# Altium project GreenHouse-hwd.PrjPcb (part 1 of 2)
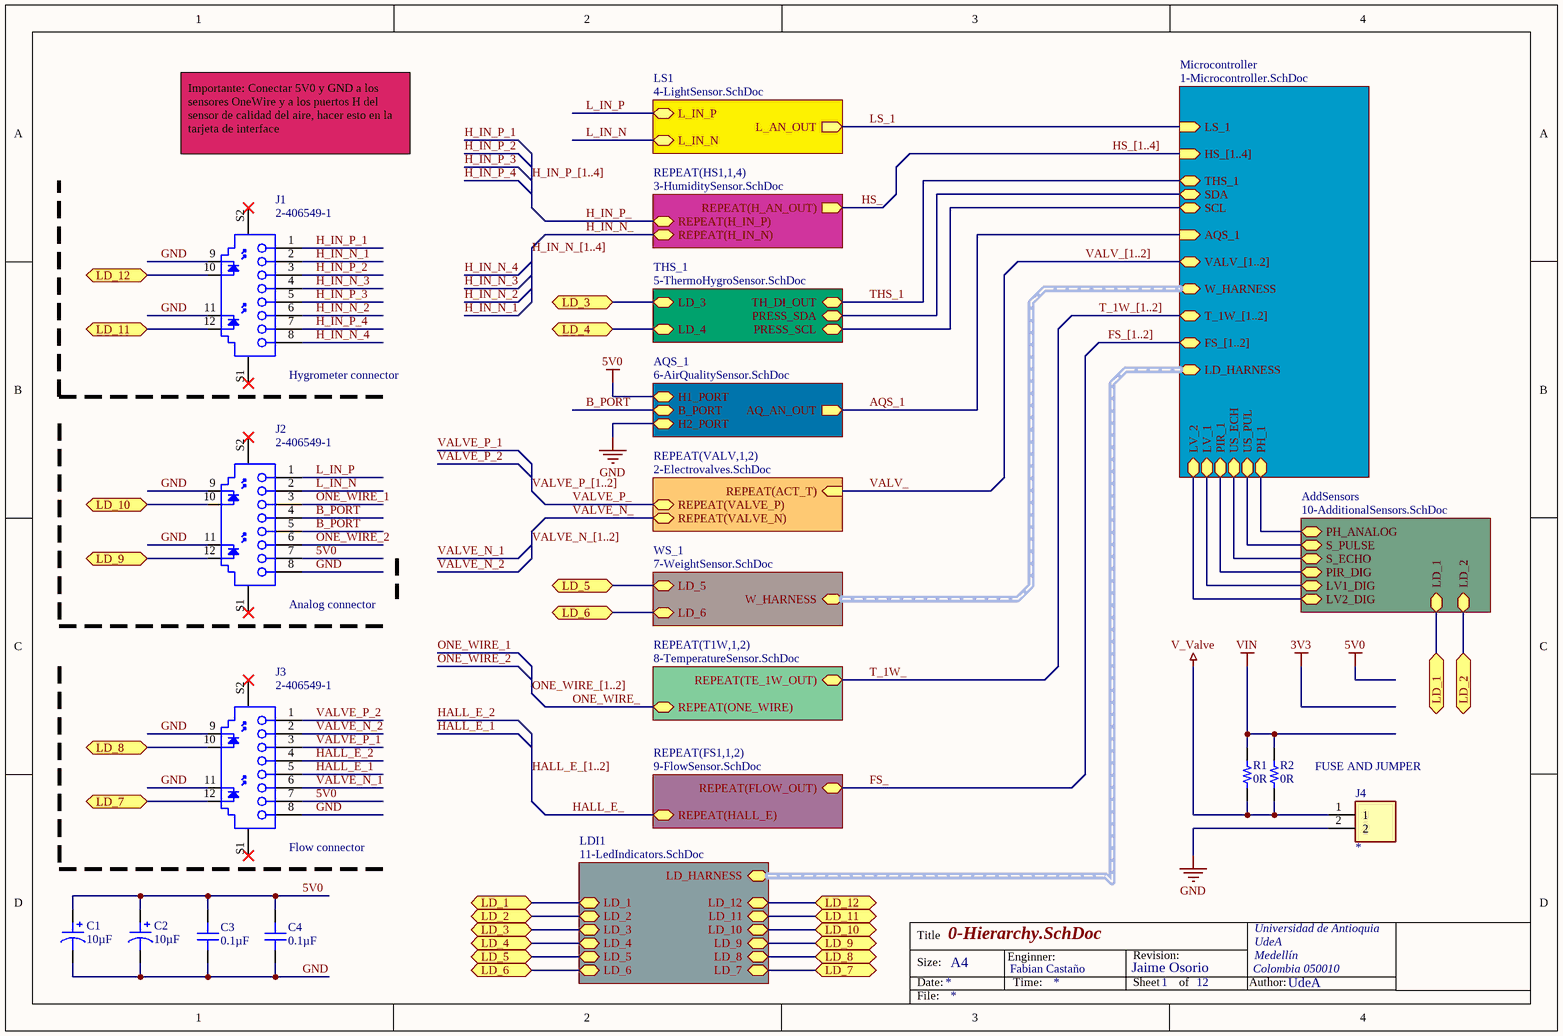
[diagram p0: 0-Hierarchy.SchDoc]
12 sheets, 90 parts. Net scope: hierarchical (ports join the sheet entries above them; power ports are global).
Board file: GreenHose-PCB.PcbDoc
Sheets:
  0-Hierarchy.SchDoc
    Microcontroller = 1-Microcontroller.SchDoc
    HS11 = 3-HumiditySensor.SchDoc
    HS12 = 3-HumiditySensor.SchDoc
    HS13 = 3-HumiditySensor.SchDoc
    HS14 = 3-HumiditySensor.SchDoc
    LS1 = 4-LightSensor.SchDoc
    THS_1 = 5-ThermoHygroSensor.SchDoc
    AQS_1 = 6-AirQualitySensor.SchDoc
    VALV1 = 2-Electrovalves.SchDoc
    VALV2 = 2-Electrovalves.SchDoc
    WS_1 = 7-WeightSensor.SchDoc
    T1W1 = 8-TemperatureSensor.SchDoc
    T1W2 = 8-TemperatureSensor.SchDoc
    FS11 = 9-FlowSensor.SchDoc
    FS12 = 9-FlowSensor.SchDoc
    AddSensors = 10-AdditionalSensors.SchDoc
    LDI1 = 11-LedIndicators.SchDoc

## Sheet 0-Hierarchy.SchDoc
size A4; Author: Fabian Castaño; CompanyName: UdeA; Engineer: Fabian Castaño; Organization: Universidad de Antioquia; Address1: UdeA; Address2: Medellín; Address3: Antioquia; Address4: Colombia 050010; DocumentNumber: 1; Revision: Jaime Osorio; SheetNumber: 1; SheetTotal: 12

### Parts
C1  10µF  [CAP POL 1206_3216]
C2  10µF  [CAP POL 1206_3216]
C3  0.1µF  [CAP 0805_2012]
C4  0.1µF  [CAP 0805_2012]
J1  2-406549-1  [TECO-2-406549-1_V]
J2  2-406549-1  [TECO-2-406549-1_V]
J3  2-406549-1  [TECO-2-406549-1_V]
J4  282841-2  [TE_282841-2]  (value not drawn)
R1  0R  [RES 0805_2012]
R2  0R  [RES 0805_2012]

### Sub-sheets
AddSensors = 10-AdditionalSensors.SchDoc: PH_ANALOG, S_PULSE, S_ECHO, PIR_DIG, LV1_DIG, LV2_DIG, LD_1 (bidir), LD_2 (bidir)
AQS_1 = 6-AirQualitySensor.SchDoc: AQ_AN_OUT (out), B_PORT, H1_PORT, H2_PORT
LDI1 = 11-LedIndicators.SchDoc: LD_HARNESS (harness LedHarness), LD_1, LD_2, LD_3, LD_4, LD_5, LD_6, LD_7, LD_8, LD_9, LD_10, LD_11, LD_12
LS1 = 4-LightSensor.SchDoc: L_AN_OUT (out), L_IN_P, L_IN_N
Microcontroller = 1-Microcontroller.SchDoc: HS_[1..4] (in), LS_1 (in), THS_1, AQS_1 (in), VALV_[1..2], W_HARNESS (harness Weight_Harness), T_1W_[1..2], FS_[1..2], SDA, SCL, LV_2, LV_1, PIR_1, US_ECH, US_PUL, PH_1, LD_HARNESS (harness LedHarness)
REPEAT(FS1,1,2) = 9-FlowSensor.SchDoc: REPEAT(FLOW_OUT), REPEAT(HALL_E)
REPEAT(HS1,1,4) = 3-HumiditySensor.SchDoc: REPEAT(H_AN_OUT) (out), REPEAT(H_IN_P), REPEAT(H_IN_N)
REPEAT(T1W,1,2) = 8-TemperatureSensor.SchDoc: REPEAT(TE_1W_OUT), REPEAT(ONE_WIRE)
REPEAT(VALV,1,2) = 2-Electrovalves.SchDoc: REPEAT(ACT_T) (in), REPEAT(VALVE_N), REPEAT(VALVE_P)
THS_1 = 5-ThermoHygroSensor.SchDoc: TH_DI_OUT, PRESS_SDA, PRESS_SCL, LD_3, LD_4
WS_1 = 7-WeightSensor.SchDoc: W_HARNESS (harness Weight_Harness), LD_5, LD_6

### Ports
LD_1 (bidir), LD_2 (bidir), LD_3 (bidir), LD_4 (bidir), LD_5 (bidir), LD_6 (bidir), LD_7 (bidir), LD_8 (bidir), LD_9 (bidir), LD_10 (bidir), LD_11 (bidir), LD_12 (bidir)

### Nets
5V0: C1.1 C2.1 C3.2 C4.2 J2.7 J3.7 ; sheet AQS_1/H1_PORT
GND: C1.2 C2.2 C3.1 C4.1 J1.9 J1.11 J2.8 J2.9 J2.11 J3.8 J3.9 J3.11 J4.2 ; sheet AQS_1/H2_PORT
V_Valve: J4.1 R1.1 R2.1
VIN: R1.2 R2.2
AQS_1: J2.4 J2.5 ; sheet Microcontroller/AQS_1, sheet AQS_1/AQ_AN_OUT, sheet AQS_1/B_PORT  [also labelled B_PORT]
FS_: sheet REPEAT(FS1,1,2)/REPEAT(FLOW_OUT)
H_IN_N_: sheet REPEAT(HS1,1,4)/REPEAT(H_IN_N)
H_IN_N_1: J1.2
H_IN_N_2: J1.6
H_IN_N_3: J1.4
H_IN_N_4: J1.8
H_IN_P_: sheet REPEAT(HS1,1,4)/REPEAT(H_IN_P)
H_IN_P_1: J1.1  [also labelled HS_1]
H_IN_P_2: J1.3  [also labelled HS_2]
H_IN_P_3: J1.5  [also labelled HS_3]
H_IN_P_4: J1.7  [also labelled HS_4]
HALL_E_: sheet REPEAT(FS1,1,2)/REPEAT(HALL_E)
HALL_E_1: J3.5
HALL_E_2: J3.4
HS_: sheet REPEAT(HS1,1,4)/REPEAT(H_AN_OUT)
L_IN_N: J2.2 ; sheet LS1/L_IN_N
L_IN_P: J2.1 ; sheet Microcontroller/LS_1, sheet LS1/L_AN_OUT, sheet LS1/L_IN_P  [also labelled LS_1]
ONE_WIRE_: sheet REPEAT(T1W,1,2)/REPEAT(ONE_WIRE)
ONE_WIRE_1: J2.3
ONE_WIRE_2: J2.6
T_1W_: sheet REPEAT(T1W,1,2)/REPEAT(TE_1W_OUT)
THS_1: sheet Microcontroller/THS_1, sheet THS_1/TH_DI_OUT
VALV_: sheet REPEAT(VALV,1,2)/REPEAT(ACT_T)
VALVE_N_: sheet REPEAT(VALV,1,2)/REPEAT(VALVE_N)
VALVE_N_1: J3.6
VALVE_N_2: J3.2
VALVE_P_: sheet REPEAT(VALV,1,2)/REPEAT(VALVE_P)
VALVE_P_1: J3.3
VALVE_P_2: J3.1
NetJ1_10: J1.10 ; port LD_12, sheet LDI1/LD_12
NetJ1_12: J1.12 ; port LD_11, sheet LDI1/LD_11
NetJ2_10: J2.10 ; port LD_10, sheet LDI1/LD_10
NetJ2_12: J2.12 ; port LD_9, sheet LDI1/LD_9
NetJ3_10: J3.10 ; port LD_8, sheet LDI1/LD_8
NetJ3_12: J3.12 ; port LD_7, sheet LDI1/LD_7
NetJ5_4: sheet Microcontroller/SDA, sheet THS_1/PRESS_SDA
NetJ5_5: sheet Microcontroller/SCL, sheet THS_1/PRESS_SCL
NetJ5_10: port LD_4, sheet THS_1/LD_4, sheet LDI1/LD_4
NetJ5_12: port LD_3, sheet THS_1/LD_3, sheet LDI1/LD_3
NetJ6_10: port LD_6, sheet WS_1/LD_6, sheet LDI1/LD_6
NetJ6_12: port LD_5, sheet WS_1/LD_5, sheet LDI1/LD_5
NetJ8_1: sheet Microcontroller/US_PUL, sheet AddSensors/S_PULSE
NetJ8_2: sheet Microcontroller/US_ECH, sheet AddSensors/S_ECHO
NetJ8_3: sheet Microcontroller/PIR_1, sheet AddSensors/PIR_DIG
NetJ8_4: sheet Microcontroller/LV_1, sheet AddSensors/LV1_DIG
NetJ8_5: sheet Microcontroller/LV_2, sheet AddSensors/LV2_DIG
NetJ8_6: sheet Microcontroller/PH_1, sheet AddSensors/PH_ANALOG
NetJ8_10: port LD_2, sheet AddSensors/LD_2, sheet LDI1/LD_2
NetJ8_12: port LD_1, sheet AddSensors/LD_1, sheet LDI1/LD_1

Not connected (* = marked no-connect by the designer): J1 S1* S2*; J2 S1* S2*; J3 S1* S2*

### Buses and harness runs
bus FS_[1..2] = sheet Microcontroller/FS_[1..2]
bus H_IN_N_[1..4]
bus H_IN_P_[1..4]
bus HALL_E_[1..2]
bus HS_[1..4] = sheet Microcontroller/HS_[1..4]
bus ONE_WIRE_[1..2]
bus T_1W_[1..2] = sheet Microcontroller/T_1W_[1..2]
bus VALV_[1..2] = sheet Microcontroller/VALV_[1..2]
bus VALVE_N_[1..2]
bus VALVE_P_[1..2]
harness sheet LDI1/LD_HARNESS = sheet Microcontroller/LD_HARNESS
harness sheet Microcontroller/W_HARNESS = sheet WS_1/W_HARNESS

### Notes on the sheet
- Importante: Conectar 5V0 y GND a los sensores OneWire y a los puertos H del sensor de calidad del aire, hacer esto en la tarjeta de interface
- (near J1) Hygrometer connector
- (near J2) Analog connector
- FUSE AND JUMPER
- (near J3) Flow connector
- Title
- Size:
- Date:
- A4
- Enginner:
- Time:
- Revision:
- Sheet
- of
- Author:
- File:

### Library data of the parts
C1 C2 = TCNK106M025R0350: CAP TANT POLY 10UF 25V 1206; Manufacturer: AVX Corporation; Manufacturer Size Code: K; ESR (Equivalent Series Resistance): 350mOhm @ 100kHz; Lifetime @ Temp.: 2000 Hrs @ 105°C; Tolerance: ±20%; Type: Molded; Part Number: TCNK106M025R0350; Value: 10µF; Capacitance: 10µF; ComponentLink1Description: Datasheet; ComponentLink1URL: http://datasheets.avx.com/TCN_Undertab.pdf; ComponentLink2Description: DigiKey Link; ComponentLink2URL: http://digikey.com/product-detail/en/avx-corporation/TCNK106M025R0350/478-12519-1-ND/9836496; Device Package: 1206 (3216 Metric); Features: General Purpose; Height - Seated (Max): 0.039" (1.00mm); LastUpdated: 2/09/2020 01:16:26; Lifecycle Status: Active; Minimum Order: 1; Mounting Type: Surface Mount; Operating Temperature: -55°C ~ 105°C; Package / Case: 1206 (3216 Metric); Packaging: TapeAndReel; PartId: 2; Part Status: Active; Price: 0.41; Series: TCN; Size / Dimension: 0.126" L x 0.063" W (3.20mm x 1.60mm); Supplier 1: DigiKey; Supplier Part Number 1: 478-12519-1-ND; Voltage - Rated: 25V
C3 C4 = C0805C104M5RACAUTO: CAP CER 0.1UF 50V X7R 0805; Manufacturer: KEMET; Tolerance: ±20%; Part Number: C0805C104M5RACAUTO; Value: 0.1µF; Applications: Automotive, Bypass, Decoupling; Capacitance: 0.1µF; ComponentLink1Description: Datasheet; ComponentLink1URL: https://api.kemet.com/component-edge/download/datasheet/C0805C104M5RACAUTO.pdf; ComponentLink2Description: DigiKey Link; ComponentLink2URL: http://digikey.com/product-detail/en/kemet/C0805C104M5RACAUTO/399-12977-1-ND/5762259; Device Package: 0805 (2012 Metric); LastUpdated: 2/09/2020 01:04:42; Lifecycle Status: Active; Minimum Order: 1; Mounting Type: Surface Mount, MLCC; Operating Temperature: -55°C ~ 125°C; Package / Case: 0805 (2012 Metric); Packaging: TapeAndReel; PartId: 2568; Part Status: Active; Price: 0.02; Ratings: AEC-Q200; Series: SMD Auto X7R; Size / Dimension: 0.079" L x 0.049" W (2.00mm x 1.25mm); Supplier 1: DigiKey; Supplier Part Number 1: 399-12977-1-ND; Temperature Coefficient: X7R; Thickness (Max): 0.035" (0.88mm); Voltage - Rated: 50V
J1-J3 = CMP-2000-05541-1: RJ45 Connector, Pitch 1.016 mm, 8 Position, Height 14.22 mm, Tail Length 3.18 mm, RoHS, Tray; Manufacturer: TE Connectivity; Number of Ports: 1; Tab Direction: Up; Ratings: Cat5; Catalog Drawings: JackSideEntryInverted / JackSideEntryInvertedSide; Number of Positions/Contacts: 8p8c(RJ45,Ethernet); 3D Model: 2-406549-1.pdf; Other Names: 2-406549-1-ND / A97715; Shielding: Shielded,EMIFinger; LED Color: Yellow-Green; Dynamic Catalog: ModularJacks; Connector Type: Jack; Termination: Solder; Mounting Type: ThroughHole; Datasheet URL: http://www.te.com/commerce/DocumentDelivery/DDEController?Action=showdoc&DocId=Customer+Drawing%7F406549%7FT%7Fpdf%7FEnglish%7FENG_CD_406549_T.pdf%7F2-406549-1; Mounting Technology: ThroughHole; Package Reference: 2-406549-1; RoHS Information: 2-406549-1StatementofCompliance; Housing Material: Thermoplastic; Standard Package: 63; Number of Rows: 1; Category: Connectors,Interconnects; Contact Material: PhosphorBronze; Contact Finish Thickness: 50µin(1.27µm); Family: ModularConnectors-Jacks; Packaging: Tray; Datasheet Version: Rev. T, 11/2014; Operating Temperature: -40°C~85°C; Orientation: 90°Angle(Right); Contact Finish: Gold; Features: BoardGuide; Package Description: RJ45 Connector, Pitch 1.016 mm, 8 Position, Height 14.22 mm, Tail Length 3.18 mm; Manufacturer URL: http://www.te.com/
J4 = 282841-2: Conn Terminal Block 2 POS 5.08mm Solder ST Thru-Hole 17.5A/Contact; MF: TE Connectivity; SnapEDA_Link: https://www.snapeda.com/parts/282841-2/TE%20Connectivity%20AMP%20Connectors/view-part/434231/?ref=snap; Availability: Unavailable; TE_purchase_URL: https://www.te.com/usa-en/product-282841-2.html?te_bu=Cor&te_type=disp&te_campaign=seda_glo_cor-seda-global-disp-prtnr-fy19-seda-model-bom-cta_sma-317_1&elqCampaignId=32493; Value: *; EU_RoHS_Compliance: Compliant with Exemptions; Price: None; MP: 282841-2; Package: None; Comment_1: *
R1 R2 = RC0805FR-071K47L: RES SMD 1.47K OHM 1% 1/8W 0805; Manufacturer: Yageo; Power (Watts): 0.125W, 1/8W; Resistance: 1.47 kOhms; Temperature Coefficient: ±100ppm/°C; Part Number: RC0805FR-071K47L; Value: 0R; ComponentLink1Description: Datasheet; ComponentLink1URL: https://www.yageo.com/upload/media/product/productsearch/datasheet/rchip/PYu-RC_Group_51_RoHS_L_10.pdf; ComponentLink2Description: DigiKey Link; ComponentLink2URL: http://digikey.com/product-detail/en/yageo/RC0805FR-071K47L/311-1.47KCRCT-ND/730440; Composition: Thick Film; Device Package: 0805 (2012 Metric); Features: Moisture Resistant; Height - Seated (Max): 0.024" (0.60mm); LastUpdated: 2/09/2020 01:14:46; Lifecycle Status: Active; Minimum Order: 1; Number of Terminations: 2; Operating Temperature: -55°C ~ 155°C; Package / Case: 0805 (2012 Metric); Packaging: CutTape; PartId: 44768; Part Status: Active; Price: 0.10; Series: RC; Size / Dimension: 0.079" L x 0.049" W (2.00mm x 1.25mm); Supplier 1: DigiKey; Supplier Part Number 1: 311-1.47KCRCT-ND; Supplier Device Package: 0805; Tolerance: ±1%

## Sheet 1-Microcontroller.SchDoc
size A4; Author: Fabian Castaño; CompanyName: UdeA; Engineer: Fabian Castaño; Organization: Universidad de Antioquia; Address1: UdeA; Address2: Medellín; Address3: Antioquia; Address4: Colombia 050010; DocumentNumber: 2; Revision: Jaime Osorio; SheetNumber: 2; SheetTotal: 12
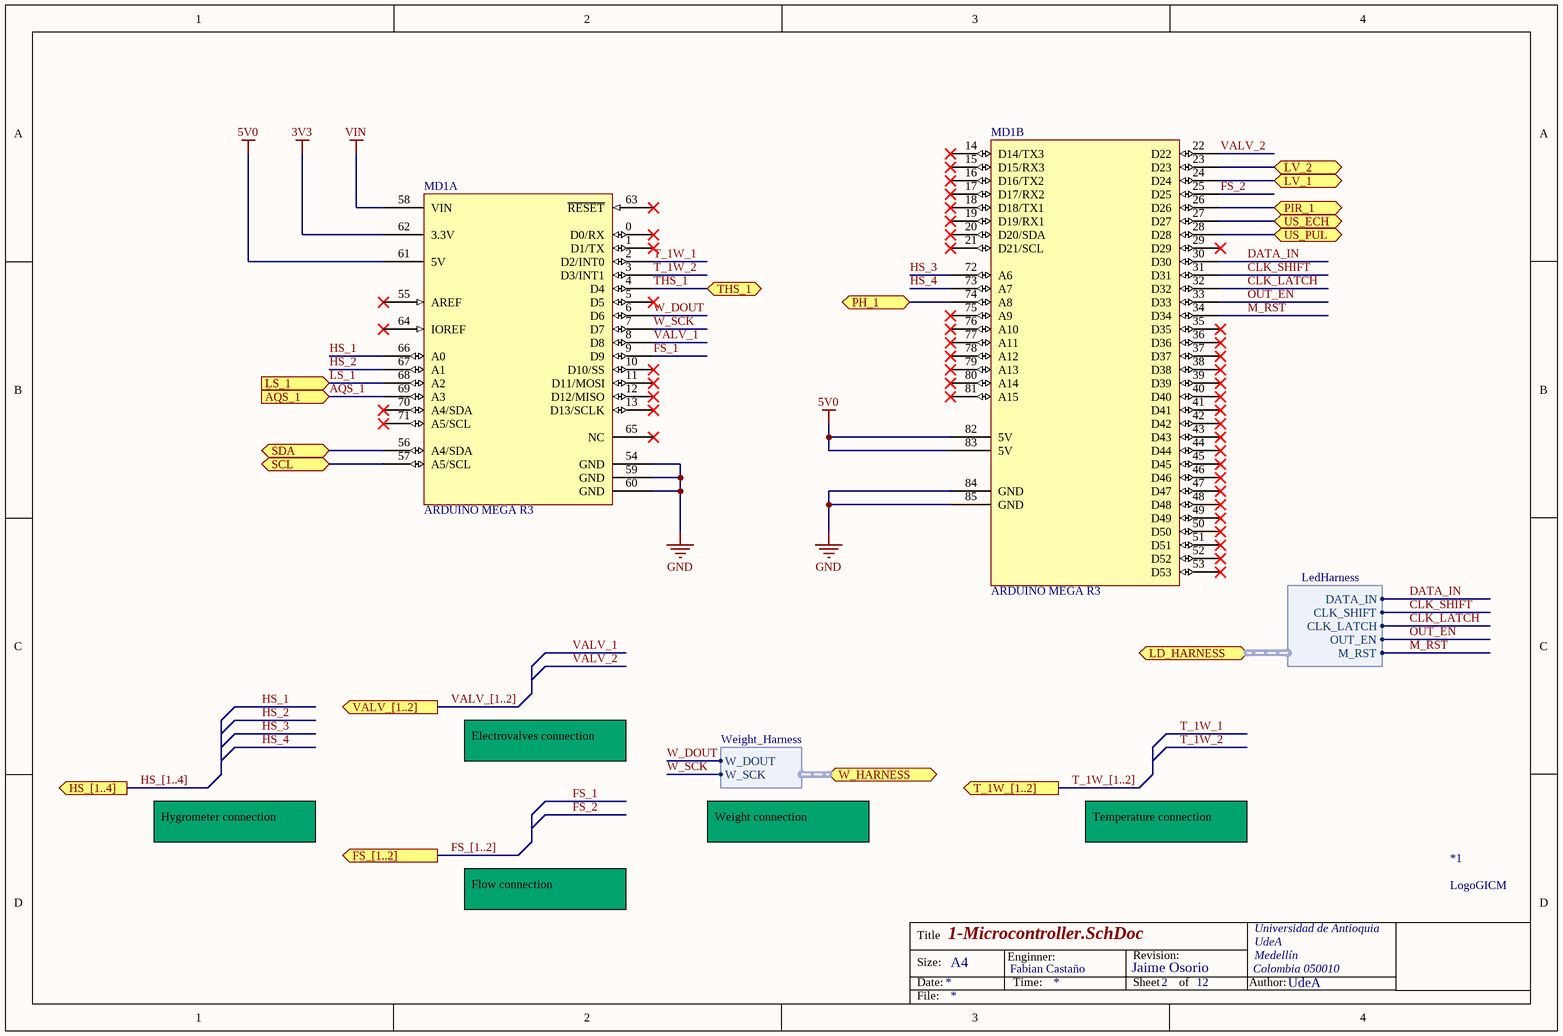
[diagram p1: 1-Microcontroller.SchDoc]

### Parts
*1  LogoGICM  [LOGO]
MD1  ARDUINO MEGA R3  [ArduinoMega]  (parts A,B of 2)

### Ports
AQS_1 (in), FS_[1..2] (out), HS_[1..4] (out), LD_HARNESS (harness LedHarness), LS_1 (in), LV_1, LV_2, PH_1, PIR_1, SCL, SDA, T_1W_[1..2] (out), THS_1, US_ECH, US_PUL, VALV_[1..2] (out), W_HARNESS (harness Weight_Harness)

### Harnesses
Weight_Harness: W_DOUT, W_SCK
LedHarness: DATA_IN, CLK_SHIFT, CLK_LATCH, OUT_EN, M_RST

### Nets
3V3: MD1.62(3.3V)
5V0: MD1.61(5V) MD1.82(5V) MD1.83(5V)
GND: MD1.54(GND) MD1.59(GND) MD1.60(GND) MD1.84(GND) MD1.85(GND)
VIN: MD1.58(VIN)
AQS_1: MD1.69(A3) ; port AQS_1
CLK_LATCH: MD1.32(D32) ; port LD_HARNESS.CLK_LATCH
CLK_SHIFT: MD1.31(D31) ; port LD_HARNESS.CLK_SHIFT
DATA_IN: MD1.30(D30) ; port LD_HARNESS.DATA_IN
FS_1: MD1.9(D9)
FS_2: MD1.25(D25)
HS_1: MD1.66(A0)  [project net H_IN_P_1]
HS_2: MD1.67(A1)  [project net H_IN_P_2]
HS_3: MD1.72(A6)  [project net H_IN_P_3]
HS_4: MD1.73(A7)  [project net H_IN_P_4]
LS_1: MD1.68(A2) ; port LS_1  [project net L_IN_P]
M_RST: MD1.34(D34) ; port LD_HARNESS.M_RST
OUT_EN: MD1.33(D33) ; port LD_HARNESS.OUT_EN
T_1W_1: MD1.2(D2/INT0)
T_1W_2: MD1.3(D3/INT1)
THS_1: MD1.4(D4) ; port THS_1
VALV_1: MD1.8(D8)
VALV_2: MD1.22(D22)
W_DOUT: MD1.6(D6) ; port W_HARNESS.W_DOUT
W_SCK: MD1.7(D7) ; port W_HARNESS.W_SCK
NetJ5_4: MD1.56(A4/SDA) ; port SDA
NetJ5_5: MD1.57(A5/SCL) ; port SCL
NetJ8_1: MD1.28(D28) ; port US_PUL
NetJ8_2: MD1.27(D27) ; port US_ECH
NetJ8_3: MD1.26(D26) ; port PIR_1
NetJ8_4: MD1.24(D24) ; port LV_1
NetJ8_5: MD1.23(D23) ; port LV_2
NetJ8_6: MD1.74(A8) ; port PH_1

Not connected (* = marked no-connect by the designer): MD1 0(D0/RX)* 1(D1/TX)* 5(D5)* 10(D10/SS)* 11(D11/MOSI)* 12(D12/MISO)* 13(D13/SCLK)* 14(D14/TX3)* 15(D15/RX3)* 16(D16/TX2)* 17(D17/RX2)* 18(D18/TX1)* 19(D19/RX1)* 20(D20/SDA)* 21(D21/SCL)* 29(D29)* 35(D35)* 36(D36)* 37(D37)* 38(D38)* 39(D39)* 40(D40)* 41(D41)* 42(D42)* 43(D43)* 44(D44)* 45(D45)* 46(D46)* 47(D47)* 48(D48)* 49(D49)* 50(D50)* 51(D51)* 52(D52)* 53(D53)* 55(AREF)* 63(~{RESET})* 64(IOREF)* 65(NC)* 70(A4/SDA)* 71(A5/SCL)* 75(A9)* 76(A10)* 77(A11)* 78(A12)* 79(A13)* 80(A14)* 81(A15)*

### Buses and harness runs
bus FS_[1..2] = port FS_[1..2]
bus HS_[1..4] = port HS_[1..4]
bus T_1W_[1..2] = port T_1W_[1..2]
bus VALV_[1..2] = port VALV_[1..2]

### Notes on the sheet
- Electrovalves connection
- Hygrometer connection
- Weight connection
- Temperature connection
- Flow connection
- Title
- Size:
- Date:
- A4
- Enginner:
- Time:
- Revision:
- Sheet
- of
- Author:
- File:

### Library data of the parts
MD1 = Arduino_Mega_R3

## Sheet 3-HumiditySensor.SchDoc
size A4; Author: Fabian Castaño; CompanyName: UdeA; Engineer: Fabian Castaño; Organization: Universidad de Antioquia; Address1: UdeA; Address2: Medellín; Address3: Antioquia; Address4: Colombia 050010; DocumentNumber: 4; Revision: Jaime Osorio; SheetNumber: 4; SheetTotal: 12
Used 4 times, as channels HS11, HS12, HS13, HS14. Parts and nets are listed once, with the designators drawn on the sheet.
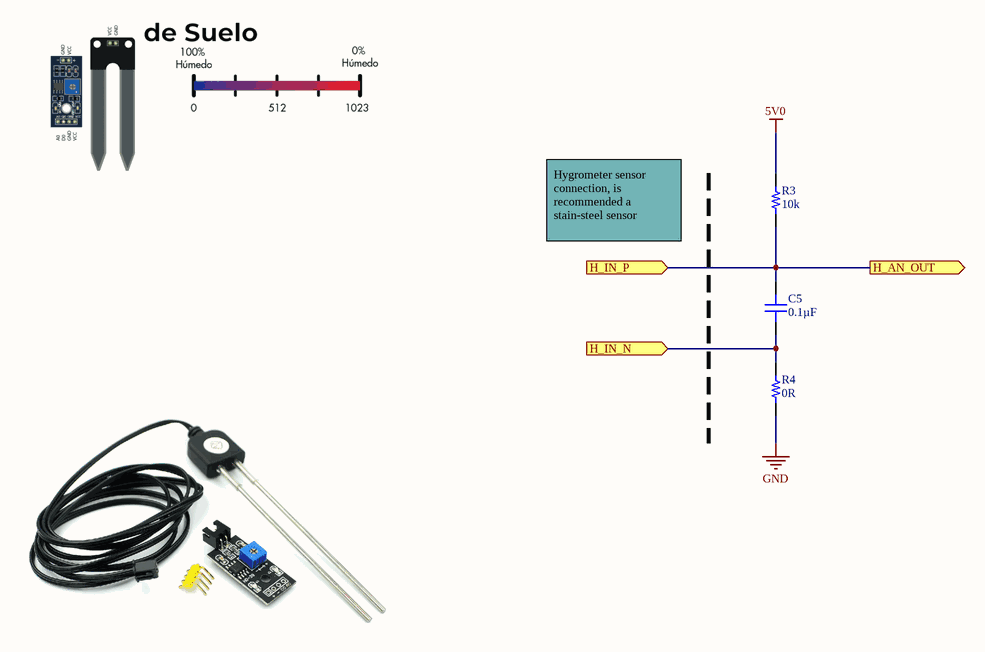
[diagram p2: 3-HumiditySensor.SchDoc]

### Parts
C5  0.1µF  [CAP 0805_2012]
R3  10k  [RES 0805_2012]
R4  0R  [RES 0805_2012]

### Ports
H_AN_OUT (out), H_IN_N (in), H_IN_P (in)

### Nets
5V0: R3.2
GND: R4.1
H_AN_OUT: C5.2 R3.1 ; port H_IN_P, port H_AN_OUT
H_IN_N: C5.1 R4.2 ; port H_IN_N

### Channels
HS11: designators end in _HS11; ports H_AN_OUT=H_IN_P_1 H_IN_N=H_IN_N_1 H_IN_P=H_IN_P_1
HS12: designators end in _HS12; ports H_AN_OUT=H_IN_P_2 H_IN_N=H_IN_N_2 H_IN_P=H_IN_P_2
HS13: designators end in _HS13; ports H_AN_OUT=H_IN_P_3 H_IN_N=H_IN_N_3 H_IN_P=H_IN_P_3
HS14: designators end in _HS14; ports H_AN_OUT=H_IN_P_4 H_IN_N=H_IN_N_4 H_IN_P=H_IN_P_4

### Notes on the sheet
- Hygrometer sensor connection, is recommended a stain-steel sensor
- Title
- Size:
- Date:
- A4
- Enginner:
- Time:
- Revision:
- Sheet
- of
- Author:
- File:

### Library data of the parts
C5 = C0805C104M5RACAUTO: as C3 on sheet 0-Hierarchy; Part Number: C0805C104M5RACAUTO; Value: 0.1µF; Applications: Automotive, Bypass, Decoupling; Capacitance: 0.1µF; ComponentLink1Description: Datasheet; ComponentLink1URL: https://api.kemet.com/component-edge/download/datasheet/C0805C104M5RACAUTO.pdf; ComponentLink2Description: DigiKey Link; ComponentLink2URL: http://digikey.com/product-detail/en/kemet/C0805C104M5RACAUTO/399-12977-1-ND/5762259; Device Package: 0805 (2012 Metric); LastUpdated: 2/09/2020 01:04:42; Lifecycle Status: Active; Minimum Order: 1; Mounting Type: Surface Mount, MLCC; Operating Temperature: -55°C ~ 125°C; Package / Case: 0805 (2012 Metric); Packaging: TapeAndReel; PartId: 2568; Part Status: Active; Price: 0.02; Ratings: AEC-Q200; Series: SMD Auto X7R; Size / Dimension: 0.079" L x 0.049" W (2.00mm x 1.25mm); Supplier 1: DigiKey; Supplier Part Number 1: 399-12977-1-ND; Temperature Coefficient: X7R; Thickness (Max): 0.035" (0.88mm); Voltage - Rated: 50V
R3 R4 = RC0805FR-071K47L: as R1 on sheet 0-Hierarchy; Part Number: RC0805FR-071K47L; ComponentLink1Description: Datasheet; ComponentLink1URL: https://www.yageo.com/upload/media/product/productsearch/datasheet/rchip/PYu-RC_Group_51_RoHS_L_10.pdf; ComponentLink2Description: DigiKey Link; ComponentLink2URL: http://digikey.com/product-detail/en/yageo/RC0805FR-071K47L/311-1.47KCRCT-ND/730440; Composition: Thick Film; Device Package: 0805 (2012 Metric); Features: Moisture Resistant; Height - Seated (Max): 0.024" (0.60mm); LastUpdated: 2/09/2020 01:14:46; Lifecycle Status: Active; Minimum Order: 1; Number of Terminations: 2; Operating Temperature: -55°C ~ 155°C; Package / Case: 0805 (2012 Metric); Packaging: CutTape; PartId: 44768; Part Status: Active; Price: 0.10; Series: RC; Size / Dimension: 0.079" L x 0.049" W (2.00mm x 1.25mm); Supplier 1: DigiKey; Supplier Part Number 1: 311-1.47KCRCT-ND; Supplier Device Package: 0805; Tolerance: ±1%
  R3: Value: 10k
  R4: Value: 0R

## Sheet 4-LightSensor.SchDoc
size A4; Author: Fabian Castaño; CompanyName: UdeA; Engineer: Fabian Castaño; Organization: Universidad de Antioquia; Address1: UdeA; Address2: Medellín; Address3: Antioquia; Address4: Colombia 050010; DocumentNumber: 5; Revision: Jaime Osorio; SheetNumber: 5; SheetTotal: 12
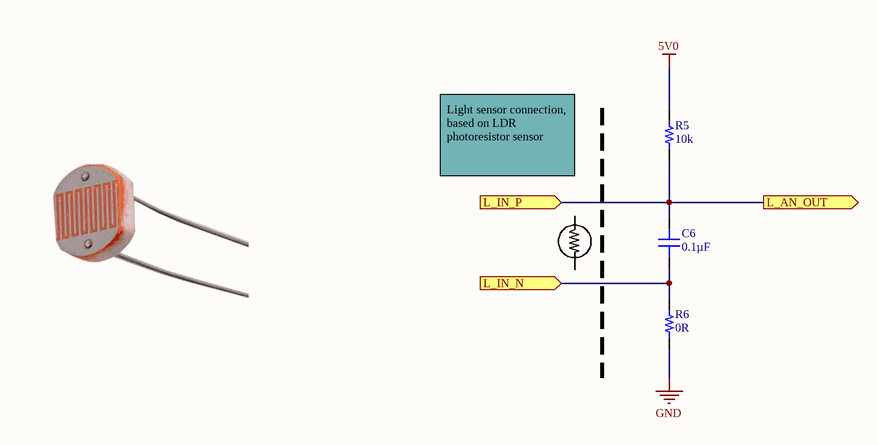
[diagram p3: 4-LightSensor.SchDoc]

### Parts
C6  0.1µF  [CAP 0805_2012]
R5  10k  [RES 0805_2012]
R6  0R  [RES 0805_2012]

### Ports
L_AN_OUT (out), L_IN_N (in), L_IN_P (in)

### Nets
5V0: R5.2
GND: R6.1
L_IN_N: C6.1 R6.2 ; port L_IN_N
L_IN_P: C6.2 R5.1 ; port L_IN_P, port L_AN_OUT

### Notes on the sheet
- Light sensor connection, based on LDR photoresistor sensor
- Title
- Size:
- Date:
- A4
- Enginner:
- Time:
- Revision:
- Sheet
- of
- Author:
- File:

### Library data of the parts
C6 = C0805C104M5RACAUTO: as C3 on sheet 0-Hierarchy; Part Number: C0805C104M5RACAUTO; Value: 0.1µF; Applications: Automotive, Bypass, Decoupling; Capacitance: 0.1µF; ComponentLink1Description: Datasheet; ComponentLink1URL: https://api.kemet.com/component-edge/download/datasheet/C0805C104M5RACAUTO.pdf; ComponentLink2Description: DigiKey Link; ComponentLink2URL: http://digikey.com/product-detail/en/kemet/C0805C104M5RACAUTO/399-12977-1-ND/5762259; Device Package: 0805 (2012 Metric); LastUpdated: 2/09/2020 01:04:42; Lifecycle Status: Active; Minimum Order: 1; Mounting Type: Surface Mount, MLCC; Operating Temperature: -55°C ~ 125°C; Package / Case: 0805 (2012 Metric); Packaging: TapeAndReel; PartId: 2568; Part Status: Active; Price: 0.02; Ratings: AEC-Q200; Series: SMD Auto X7R; Size / Dimension: 0.079" L x 0.049" W (2.00mm x 1.25mm); Supplier 1: DigiKey; Supplier Part Number 1: 399-12977-1-ND; Temperature Coefficient: X7R; Thickness (Max): 0.035" (0.88mm); Voltage - Rated: 50V
R5 R6 = RC0805FR-071K47L: as R1 on sheet 0-Hierarchy; Part Number: RC0805FR-071K47L; ComponentLink1Description: Datasheet; ComponentLink1URL: https://www.yageo.com/upload/media/product/productsearch/datasheet/rchip/PYu-RC_Group_51_RoHS_L_10.pdf; ComponentLink2Description: DigiKey Link; ComponentLink2URL: http://digikey.com/product-detail/en/yageo/RC0805FR-071K47L/311-1.47KCRCT-ND/730440; Composition: Thick Film; Device Package: 0805 (2012 Metric); Features: Moisture Resistant; Height - Seated (Max): 0.024" (0.60mm); LastUpdated: 2/09/2020 01:14:46; Lifecycle Status: Active; Minimum Order: 1; Number of Terminations: 2; Operating Temperature: -55°C ~ 155°C; Package / Case: 0805 (2012 Metric); Packaging: CutTape; PartId: 44768; Part Status: Active; Price: 0.10; Series: RC; Size / Dimension: 0.079" L x 0.049" W (2.00mm x 1.25mm); Supplier 1: DigiKey; Supplier Part Number 1: 311-1.47KCRCT-ND; Supplier Device Package: 0805; Tolerance: ±1%
  R5: Value: 10k
  R6: Value: 0R

## Sheet 5-ThermoHygroSensor.SchDoc
size A4; Author: Fabian Castaño; CompanyName: UdeA; Engineer: Fabian Castaño; Organization: Universidad de Antioquia; Address1: UdeA; Address2: Medellín; Address3: Antioquia; Address4: Colombia 050010; DocumentNumber: 6; Revision: Jaime Osorio; SheetNumber: 6; SheetTotal: 12
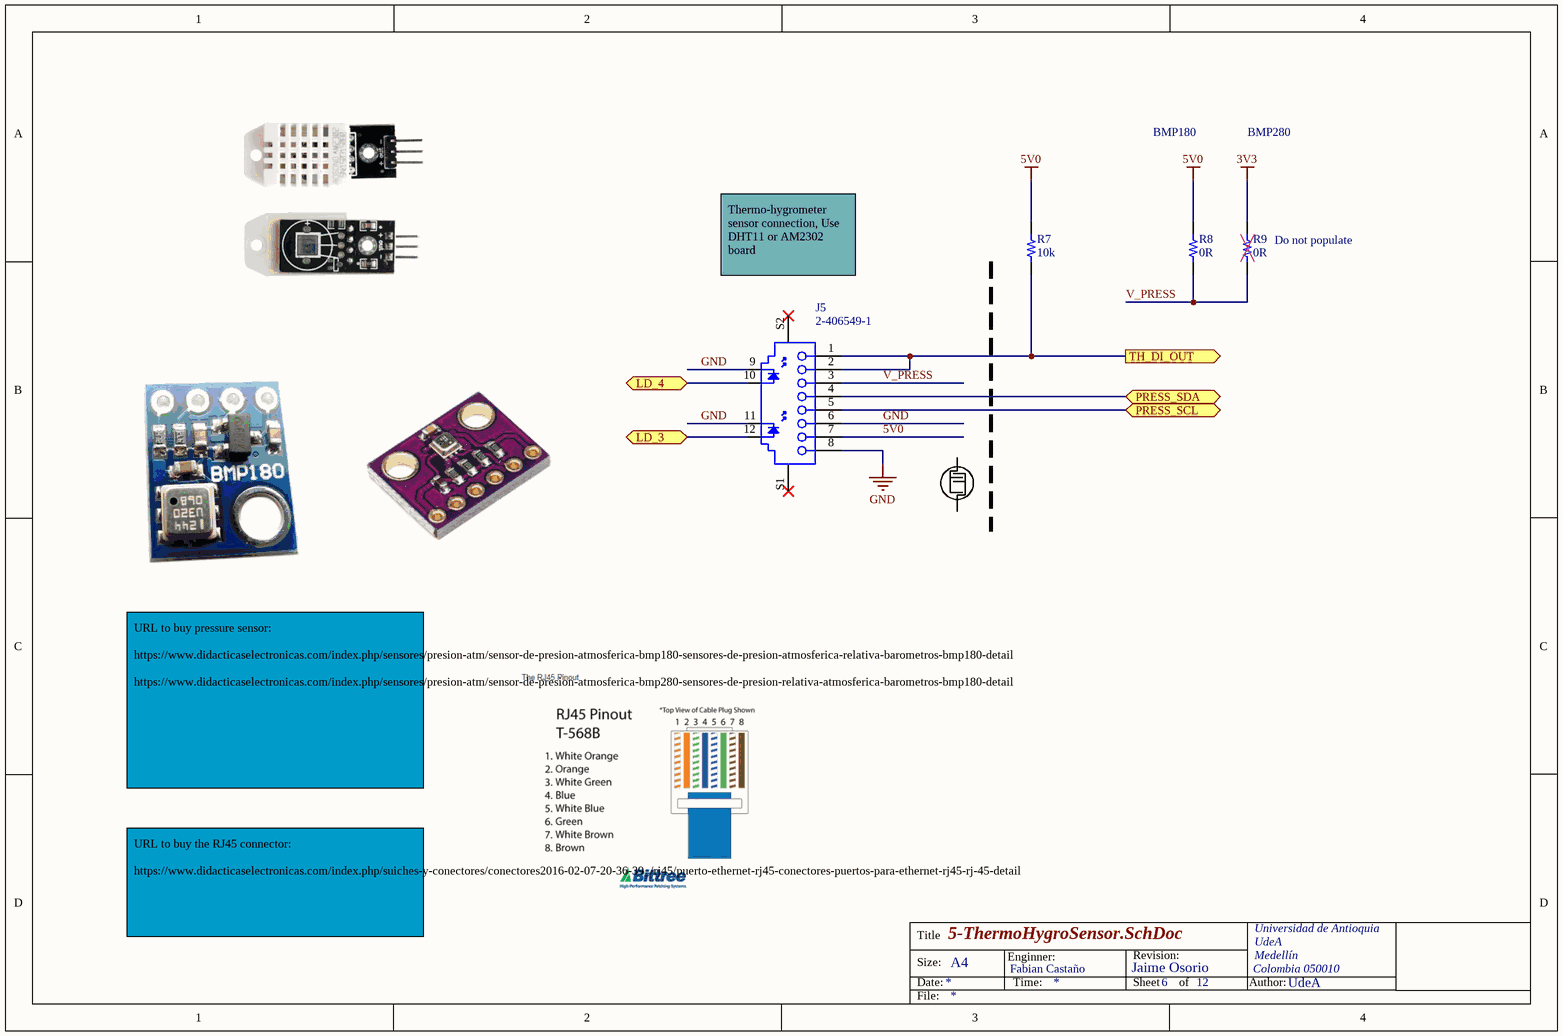
[diagram p4: 5-ThermoHygroSensor.SchDoc]

### Parts
J5  2-406549-1  [TECO-2-406549-1_V]
R7  10k  [RES 0805_2012]
R8  0R  [RES 0805_2012]
R9  0R  [RES 0805_2012]

### Ports
LD_3 (bidir), LD_4 (bidir), PRESS_SCL, PRESS_SDA, TH_DI_OUT (out)

### Nets
3V3: R9.2
5V0: J5.7 R7.2 R8.2
GND: J5.6 J5.8 J5.9 J5.11
THS_1: J5.1 J5.2 R7.1 ; port TH_DI_OUT
V_PRESS: J5.3 R8.1 R9.1
NetJ5_4: J5.4 ; port PRESS_SDA
NetJ5_5: J5.5 ; port PRESS_SCL
NetJ5_10: J5.10 ; port LD_4
NetJ5_12: J5.12 ; port LD_3

Not connected (* = marked no-connect by the designer): J5 S1* S2*

### Notes on the sheet
- BMP180
- BMP280
- (near R9) Do not populate
- Thermo-hygrometer sensor connection, Use DHT11 or AM2302 board
- URL to buy pressure sensor:
  https://www.didacticaselectronicas.com/index.php/sensores/presion-atm/sensor-de-presion-atmosferica-bmp180-sensores-de-presion-atmosferica-relativa-barometros-bmp180-detail
  https://www.didacticaselectronicas.com/index.php/sensores/presion-atm/sensor-de-presion-atmosferica-bmp280-sensores-de-presion-relativa-atmosferica-barometros-bmp180-detail
- URL to buy the RJ45 connector:
  https://www.didacticaselectronicas.com/index.php/suiches-y-conectores/conectores2016-02-07-20-36-39_/rj45/puerto-ethernet-rj45-conectores-puertos-para-ethernet-rj45-rj-45-detail
- Title
- Size:
- Date:
- A4
- Enginner:
- Time:
- Revision:
- Sheet
- of
- Author:
- File:

### Library data of the parts
J5 = CMP-2000-05541-1: as J1 on sheet 0-Hierarchy; Termination: Solder; Mounting Type: ThroughHole; Datasheet URL: http://www.te.com/commerce/DocumentDelivery/DDEController?Action=showdoc&DocId=Customer+Drawing%7F406549%7FT%7Fpdf%7FEnglish%7FENG_CD_406549_T.pdf%7F2-406549-1; Mounting Technology: ThroughHole; Package Reference: 2-406549-1; RoHS Information: 2-406549-1StatementofCompliance; Housing Material: Thermoplastic; Standard Package: 63; Number of Rows: 1; Category: Connectors,Interconnects; Contact Material: PhosphorBronze; Contact Finish Thickness: 50µin(1.27µm); Family: ModularConnectors-Jacks; Packaging: Tray; Datasheet Version: Rev. T, 11/2014; Operating Temperature: -40°C~85°C; Orientation: 90°Angle(Right); Contact Finish: Gold; Features: BoardGuide; Package Description: RJ45 Connector, Pitch 1.016 mm, 8 Position, Height 14.22 mm, Tail Length 3.18 mm; Manufacturer URL: http://www.te.com/
R7-R9 = RC0805FR-071K47L: as R1 on sheet 0-Hierarchy; Part Number: RC0805FR-071K47L; ComponentLink1Description: Datasheet; ComponentLink1URL: https://www.yageo.com/upload/media/product/productsearch/datasheet/rchip/PYu-RC_Group_51_RoHS_L_10.pdf; ComponentLink2Description: DigiKey Link; ComponentLink2URL: http://digikey.com/product-detail/en/yageo/RC0805FR-071K47L/311-1.47KCRCT-ND/730440; Composition: Thick Film; Device Package: 0805 (2012 Metric); Features: Moisture Resistant; Height - Seated (Max): 0.024" (0.60mm); LastUpdated: 2/09/2020 01:14:46; Lifecycle Status: Active; Minimum Order: 1; Number of Terminations: 2; Operating Temperature: -55°C ~ 155°C; Package / Case: 0805 (2012 Metric); Packaging: CutTape; PartId: 44768; Part Status: Active; Price: 0.10; Series: RC; Size / Dimension: 0.079" L x 0.049" W (2.00mm x 1.25mm); Supplier 1: DigiKey; Supplier Part Number 1: 311-1.47KCRCT-ND; Supplier Device Package: 0805; Tolerance: ±1%
  R7: Value: 10k
  R8 R9: Value: 0R

## Sheet 6-AirQualitySensor.SchDoc
size A4; Author: Fabian Castaño; CompanyName: UdeA; Engineer: Fabian Castaño; Organization: Universidad de Antioquia; Address1: UdeA; Address2: Medellín; Address3: Antioquia; Address4: Colombia 050010; DocumentNumber: 7; Revision: Jaime Osorio; SheetNumber: 7; SheetTotal: 12
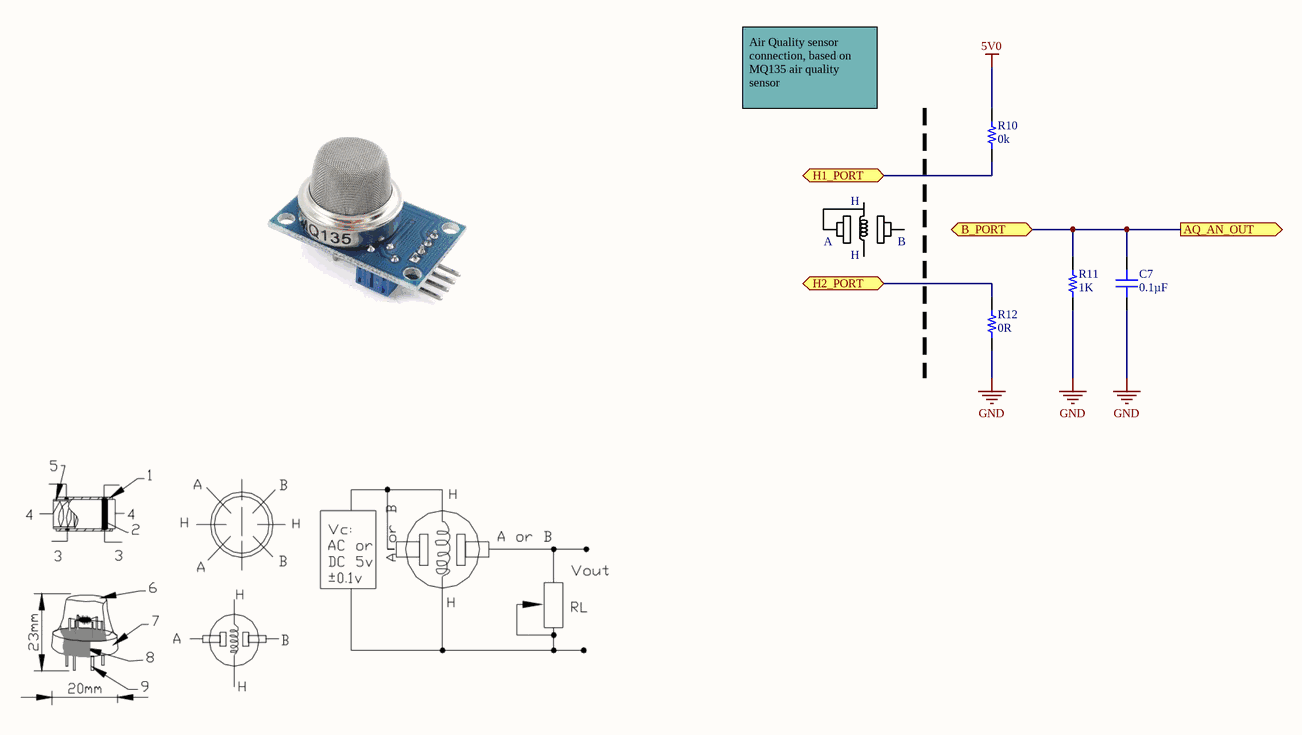
[diagram p5: 6-AirQualitySensor.SchDoc]

### Parts
C7  0.1µF  [CAP 0805_2012]
R10  0k  [RES 0805_2012]
R11  1K  [RES 0805_2012]
R12  0R  [RES 0805_2012]

### Ports
AQ_AN_OUT (out), B_PORT, H1_PORT, H2_PORT

### Nets
5V0: R10.1 R10.2 ; port H1_PORT
GND: C7.1 R11.1 R12.1 R12.2 ; port H2_PORT
AQS_1: C7.2 R11.2 ; port AQ_AN_OUT, port B_PORT

### Notes on the sheet
- Air Quality sensor connection, based on MQ135 air quality sensor
- A
- H
- B
- Title
- Size:
- Date:
- A4
- Enginner:
- Time:
- Revision:
- Sheet
- of
- Author:
- File:

### Library data of the parts
C7 = C0805C104M5RACAUTO: as C3 on sheet 0-Hierarchy; Part Number: C0805C104M5RACAUTO; Value: 0.1µF; Applications: Automotive, Bypass, Decoupling; Capacitance: 0.1µF; ComponentLink1Description: Datasheet; ComponentLink1URL: https://api.kemet.com/component-edge/download/datasheet/C0805C104M5RACAUTO.pdf; ComponentLink2Description: DigiKey Link; ComponentLink2URL: http://digikey.com/product-detail/en/kemet/C0805C104M5RACAUTO/399-12977-1-ND/5762259; Device Package: 0805 (2012 Metric); LastUpdated: 2/09/2020 01:04:42; Lifecycle Status: Active; Minimum Order: 1; Mounting Type: Surface Mount, MLCC; Operating Temperature: -55°C ~ 125°C; Package / Case: 0805 (2012 Metric); Packaging: TapeAndReel; PartId: 2568; Part Status: Active; Price: 0.02; Ratings: AEC-Q200; Series: SMD Auto X7R; Size / Dimension: 0.079" L x 0.049" W (2.00mm x 1.25mm); Supplier 1: DigiKey; Supplier Part Number 1: 399-12977-1-ND; Temperature Coefficient: X7R; Thickness (Max): 0.035" (0.88mm); Voltage - Rated: 50V
R10-R12 = RC0805FR-071K47L: as R1 on sheet 0-Hierarchy; Part Number: RC0805FR-071K47L; ComponentLink1Description: Datasheet; ComponentLink1URL: https://www.yageo.com/upload/media/product/productsearch/datasheet/rchip/PYu-RC_Group_51_RoHS_L_10.pdf; ComponentLink2Description: DigiKey Link; ComponentLink2URL: http://digikey.com/product-detail/en/yageo/RC0805FR-071K47L/311-1.47KCRCT-ND/730440; Composition: Thick Film; Device Package: 0805 (2012 Metric); Features: Moisture Resistant; Height - Seated (Max): 0.024" (0.60mm); LastUpdated: 2/09/2020 01:14:46; Lifecycle Status: Active; Minimum Order: 1; Number of Terminations: 2; Operating Temperature: -55°C ~ 155°C; Package / Case: 0805 (2012 Metric); Packaging: CutTape; PartId: 44768; Part Status: Active; Price: 0.10; Series: RC; Size / Dimension: 0.079" L x 0.049" W (2.00mm x 1.25mm); Supplier 1: DigiKey; Supplier Part Number 1: 311-1.47KCRCT-ND; Supplier Device Package: 0805; Tolerance: ±1%
  R10: Value: 0k
  R11: Value: 1K
  R12: Value: 0R

## Sheet 2-Electrovalves.SchDoc
size A4; Author: Fabian Castaño; CompanyName: UdeA; Engineer: Fabian Castaño; Organization: Universidad de Antioquia; Address1: UdeA; Address2: Medellín; Address3: Antioquia; Address4: Colombia 050010; DocumentNumber: 3; Revision: Jaime Osorio; SheetNumber: 3; SheetTotal: 12
Used 2 times, as channels VALV1, VALV2. Parts and nets are listed once, with the designators drawn on the sheet.
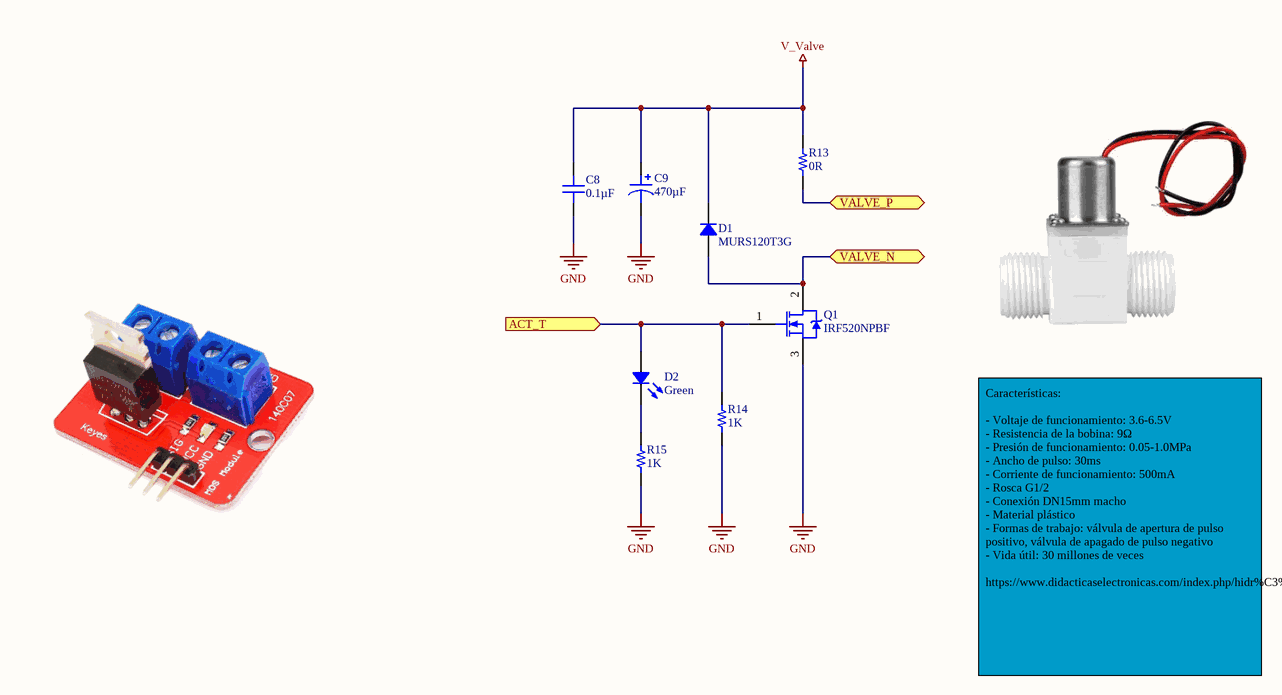
[diagram p6: 2-Electrovalves.SchDoc]

### Parts
C8  0.1µF  [CAP 0805_2012]
C9  470µF  [CAP TH ALUM ELEC D10.00mm S5.00mm H14.50mm]
D1  MURS120T3G  [DO214AA SMB]
D2  Green  [LED 0805_2012 YELLOW]
Q1  IRF520NPBF  [INTR-TO-220AB-3]
R13  0R  [RES 0805_2012]
R14  1K  [RES 0805_2012]
R15  1K  [RES 0805_2012]

### Ports
ACT_T (in), VALVE_N, VALVE_P

### Nets
GND: C8.1 C9.2 Q1.3(S) R14.1 R15.1
V_Valve: C8.2 C9.1 D1.2 R13.2
ACT_T: D2.1 Q1.1(G) R14.2 ; port ACT_T
VALVE_N: D1.1 Q1.2(D) ; port VALVE_N
VALVE_P: R13.1 ; port VALVE_P
NetD2_2: D2.2 R15.2

### Channels
VALV1: designators end in _VALV1; ports ACT_T=VALV_1 VALVE_N=VALVE_N_1 VALVE_P=VALVE_P_1
VALV2: designators end in _VALV2; ports ACT_T=VALV_2 VALVE_N=VALVE_N_2 VALVE_P=VALVE_P_2

### Notes on the sheet
- Características:
  - Voltaje de funcionamiento: 3.6-6.5V
  - Resistencia de la bobina: 9Ω
  - Presión de funcionamiento: 0.05-1.0MPa
  - Ancho de pulso: 30ms
  - Corriente de funcionamiento: 500mA
  - Rosca G1/2
  - Conexión DN15mm macho
  - Material plástico
  - Formas de trabajo: válvula de apertura de pulso positivo, válvula de apagado de pulso negativo
  - Vida útil: 30 millones de veces
  https://www.didacticaselectronicas.com/index.php/hidr%C3%A1ulica-y-neum%C3%A1tica/v%C3%A1lvulas/electrov%C3%A1lvula-pl%C3%A1stica-211b-v%C3%A1lvulas-solenoides-electrov%C3%A1lvulas-sensores-de-flujo-electro-valvulas-v%C3%A1lvulas-electromagn%C3%A9ticas-de-pulsos-pl%C3%A1sticas-de-pulsos-detail
- Title
- Size:
- Date:
- A4
- Enginner:
- Time:
- Revision:
- Sheet
- of
- Author:
- File:

### Library data of the parts
C8 = C0805C104M5RACAUTO: as C3 on sheet 0-Hierarchy; Part Number: C0805C104M5RACAUTO; Value: 0.1µF; Applications: Automotive, Bypass, Decoupling; Capacitance: 0.1µF; ComponentLink1Description: Datasheet; ComponentLink1URL: https://api.kemet.com/component-edge/download/datasheet/C0805C104M5RACAUTO.pdf; ComponentLink2Description: DigiKey Link; ComponentLink2URL: http://digikey.com/product-detail/en/kemet/C0805C104M5RACAUTO/399-12977-1-ND/5762259; Device Package: 0805 (2012 Metric); LastUpdated: 2/09/2020 01:04:42; Lifecycle Status: Active; Minimum Order: 1; Mounting Type: Surface Mount, MLCC; Operating Temperature: -55°C ~ 125°C; Package / Case: 0805 (2012 Metric); Packaging: TapeAndReel; PartId: 2568; Part Status: Active; Price: 0.02; Ratings: AEC-Q200; Series: SMD Auto X7R; Size / Dimension: 0.079" L x 0.049" W (2.00mm x 1.25mm); Supplier 1: DigiKey; Supplier Part Number 1: 399-12977-1-ND; Temperature Coefficient: X7R; Thickness (Max): 0.035" (0.88mm); Voltage - Rated: 50V
C9 = UBT1J470MPD1TD: CAP ALUM 47UF 20% 63V RADIAL; manufacturer: Nichicon; Capacitance: 47µF; Impedance: 590 mOhms; Lifetime @ Temp.: 3000 Hrs @ 125°C; Polarization: Polar; Ripple Current @ High Frequency: 530mA @ 100kHz; Ripple Current @ Low Frequency: 265mA @ 120Hz; Part Number: UBT1J470MPD1TD; Applications: Automotive; componentlink1description: Datasheet; componentlink1url: http://nichicon-us.com/english/products/pdfs/e-ubt.pdf; componentlink2description: DigiKey Link; componentlink2url: http://digikey.com/product-detail/en/nichicon/UBT1J470MPD1TD/493-4512-1-ND/2650352; Device Package: Radial, Can; Height - Seated (Max): 0.571" (14.50mm); lastupdated: 2/09/2020 1:31:15 a. m.; Lead Spacing: 0.197" (5.00mm); Lifecycle Status: Active; Minimum Order: 1; Mounting Type: Through Hole; Operating Temperature: -40°C ~ 125°C; Package / Case: Radial, Can; packaging: TapeAndBox; partid: 11460; Part Status: Active; price: 0.29; series: UBT; Size / Dimension: 0.394" Dia (10.00mm); Supplier 1: DigiKey; Supplier Part Number 1: 493-4512-1-ND; Tolerance: ±20%; value: 470µF; Voltage - Rated: 63V
D1 = MURS120T3G: DIODE GEN PURP 200V 2A SMB; Manufacturer: ON Semiconductor; Current - Reverse Leakage @ Vr: 2µA @ 200V; Diode Type: Standard; Reverse Recovery Time (trr): 35ns; Speed: Fast Recovery =< 500ns, > 200mA (Io); Voltage - Forward (Vf) (Max) @ If: 875mV @ 1A; Part Number: MURS120T3G; ComponentLink1Description: Datasheet; ComponentLink1URL: https://www.onsemi.com/pub/Collateral/MURS120T3-D.PDF; ComponentLink2Description: DigiKey Link; ComponentLink2URL: http://digikey.com/product-detail/en/on-semiconductor/MURS120T3G/MURS120T3GOSCT-ND/964577; Current - Average Rectified (Io): 2A; LastUpdated: 12/04/2022 10:48:18 p. m.; Lifecycle Status: Active; Minimum Order: 1; Mounting Type: Surface Mount; Operating Temperature - Junction: -65°C ~ 175°C; Package / Case: DO-214AA, SMB; Packaging: TapeAndReel; PartId: 35; Part Status: Active; Price: 0.09; Series: -; Supplier 1: DigiKey; Supplier Part Number 1: MURS120T3GOSCT-ND; Supplier Device Package: SMB; Voltage - DC Reverse (Vr) (Max): 200V
D2 = APT2012SYCK: LED YELLOW CLEAR CHIP SMD; Manufacturer: Kingbright; Configuration: Standard; Current - Test: 20mA; Lens Color: Colorless; Lens Size: 1.30mm x 1.25mm; Lens Style: Rectangle with Flat Top; Millicandela Rating: 150mcd; Viewing Angle: 120°; Voltage - Forward (Vf) (Typ): 2V; Wavelength - Dominant: 590nm; Part Number: APT2012SYCK; Color: Yellow; ComponentLink1Description: Datasheet; ComponentLink1URL: http://www.kingbrightusa.com/images/catalog/SPEC/APT2012SYCK.pdf; ComponentLink2Description: DigiKey Link; ComponentLink2URL: https://www.digikey.com/en/products/detail/kingbright/APT2012SYCK/1747533; Device Package: 0805 (2012 Metric); Height (Max): 0.75mm; LastUpdated: 12/04/2022 10:52:50 p. m.; Lens Transparency: Clear; Lifecycle Status: Active; Minimum Order: 1; Mounting Type: Surface Mount; Package / Case: 0805 (2012 Metric); Packaging: TapeAndReel; PartId: 47; Part Status: Active; Price: 0.05; Series: -; Size / Dimension: 2.00mm L x 1.25mm W; Supplier 1: DigiKey; Supplier Part Number 1: 754-1134-1-ND; Supplier Device Package: Chip LED; Value: Green; Wavelength - Peak: 590nm
Q1 = CMP-2100-03647-1: HEXFET(R) Power MOSFET, 100 V, 9.7 A, 0.2 Ohm, -55 to 175 degC, 3-Pin FM (TO-220AB), RoHS, Tube; Manufacturer: International Rectifier; Element Configuration: Single; Rds On Max: 200mOhm; Drain to Source Voltage (Vdss): 100V; Number of Elements: 1; Continuous Drain Current (ID): 9.7A; Input Capacitance: 330pF; Gate to Source Voltage (Vgs): 20V; Power Dissipation: 48W; Rise Time: 23ns; Turn-Off Delay Time: 32ns; Turn-On Delay Time: 4.5ns; Datasheet URL: http://www.infineon.com/dgdl/irf520npbf.pdf?fileId=5546d462533600a4015355e340711985; Max Operating Temperature: 175degC; Height: 15.24mm; RoHSCompliant: true; Package Description: 3-Pin Flange Mount, Body 4.445 x 10.415 mm, Pitch 2.54 mm; Manufacturer URL: http://internationalrectifier.com/; Length: 10.54mm; Mount: ThroughHole; Lead Free: LeadFree; Drain to Source Resistance: 200mOhm; Drain to Source Breakdown Voltage: 100V; Number of Pins: 3; Case/Package: TO-220AB; Package Quantity: 50; Lead Pitch: 2.54mm; REACH SVHC: NoSVHC; Package Reference: TO-220AB; Radiation Hardening: No; Packaging: Rail/Tube; Min Operating Temperature: -55degC; Width: 4.69mm; Fall Time: 23ns; Max Power Dissipation: 48W; Datasheet Version: 37926.0; Voltage Rating (DC): 100V; Current Rating: 9.7A
R13-R15 = RC0805FR-071K47L: as R1 on sheet 0-Hierarchy; Part Number: RC0805FR-071K47L; ComponentLink1Description: Datasheet; ComponentLink1URL: https://www.yageo.com/upload/media/product/productsearch/datasheet/rchip/PYu-RC_Group_51_RoHS_L_10.pdf; ComponentLink2Description: DigiKey Link; ComponentLink2URL: http://digikey.com/product-detail/en/yageo/RC0805FR-071K47L/311-1.47KCRCT-ND/730440; Composition: Thick Film; Device Package: 0805 (2012 Metric); Features: Moisture Resistant; Height - Seated (Max): 0.024" (0.60mm); LastUpdated: 2/09/2020 01:14:46; Lifecycle Status: Active; Minimum Order: 1; Number of Terminations: 2; Operating Temperature: -55°C ~ 155°C; Package / Case: 0805 (2012 Metric); Packaging: CutTape; PartId: 44768; Part Status: Active; Price: 0.10; Series: RC; Size / Dimension: 0.079" L x 0.049" W (2.00mm x 1.25mm); Supplier 1: DigiKey; Supplier Part Number 1: 311-1.47KCRCT-ND; Supplier Device Package: 0805; Tolerance: ±1%
  R13: Value: 0R
  R14 R15: Value: 1K

## Sheet 7-WeightSensor.SchDoc
size A4; Author: Fabian Castaño; CompanyName: UdeA; Engineer: Fabian Castaño; Organization: Universidad de Antioquia; Address1: UdeA; Address2: Medellín; Address3: Antioquia; Address4: Colombia 050010; DocumentNumber: 8; Revision: Jaime Osorio; SheetNumber: 8; SheetTotal: 12
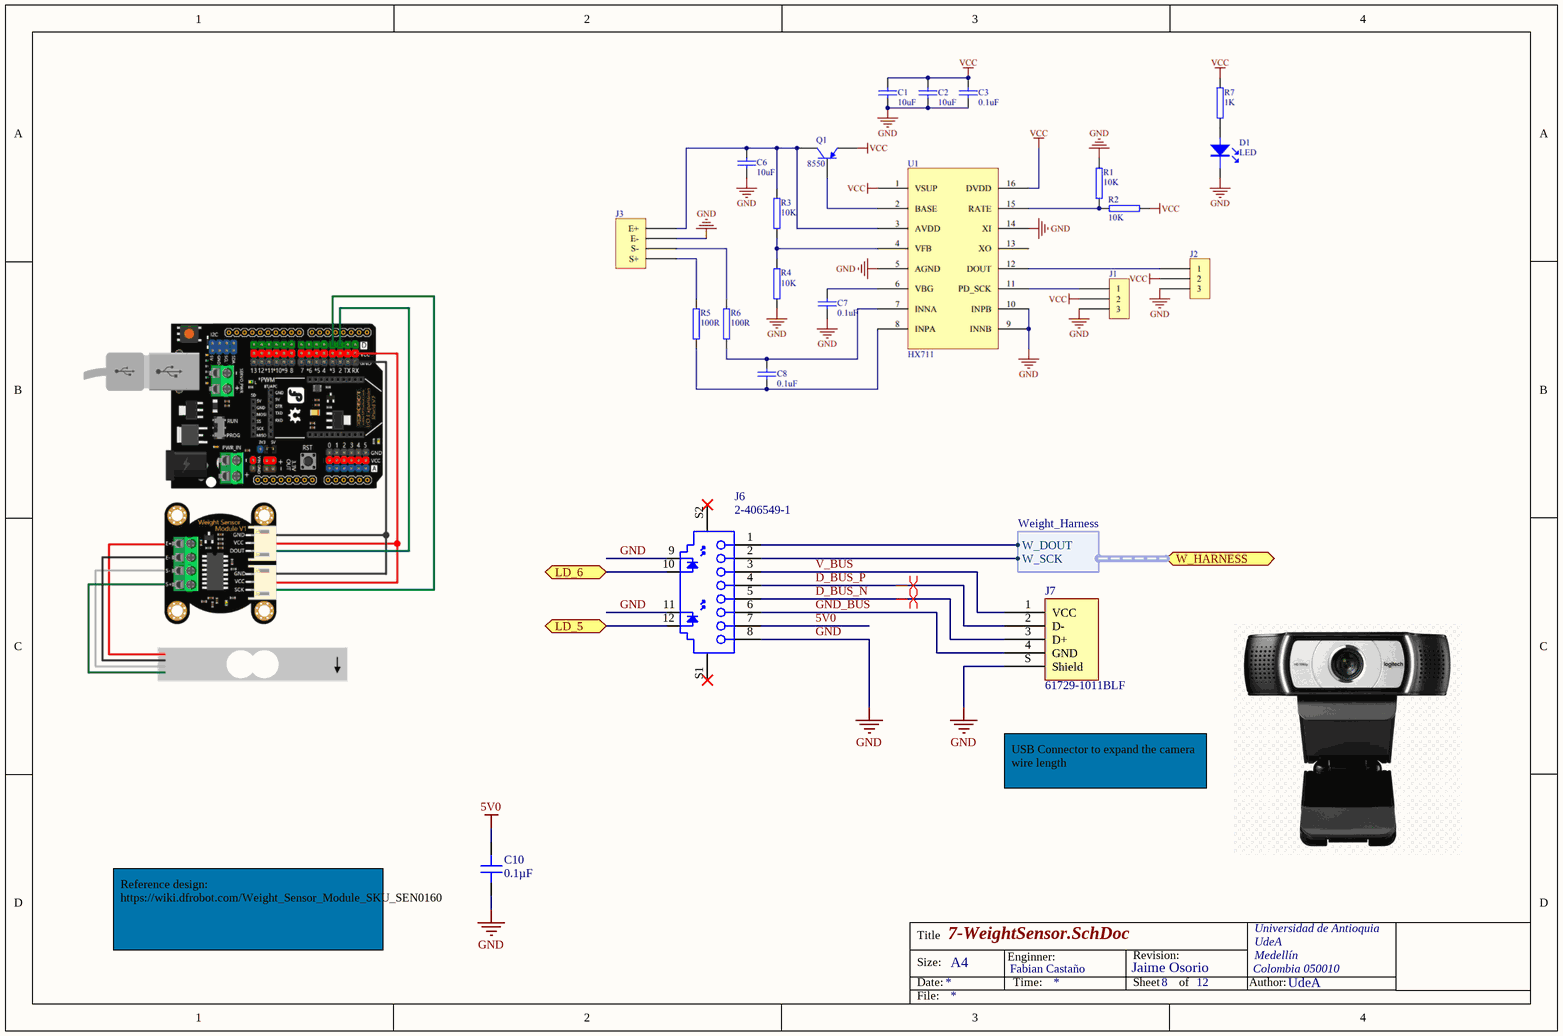
[diagram p7: 7-WeightSensor.SchDoc]

### Parts
C10  0.1µF  [CAP 0805_2012]
J6  2-406549-1  [TECO-2-406549-1_V]
J7  61729-1011BLF  [FCI USB 61729-1011BLF]

### Ports
LD_5 (bidir), LD_6 (bidir), W_HARNESS (harness Weight_Harness)

### Harnesses
Weight_Harness: W_DOUT, W_SCK

### Nets
5V0: C10.2 J6.7
GND: C10.1 J6.8 J6.9 J6.11 J7.S(Shield)
D_BUS_N: J6.5 J7.3(D+)
D_BUS_P: J6.4 J7.2(D-)
GND_BUS: J6.6 J7.4(GND)
V_BUS: J6.3 J7.1(VCC)
W_DOUT: J6.1 ; port W_HARNESS.W_DOUT
W_SCK: J6.2 ; port W_HARNESS.W_SCK
NetJ6_10: J6.10 ; port LD_6
NetJ6_12: J6.12 ; port LD_5

Not connected (* = marked no-connect by the designer): J6 S1* S2*

### Layout directives
differential pair: D_BUS_N, D_BUS_P

### Notes on the sheet
- USB Connector to expand the camera wire length
- Reference design: https://wiki.dfrobot.com/Weight_Sensor_Module_SKU_SEN0160
- Title
- Size:
- Date:
- A4
- Enginner:
- Time:
- Revision:
- Sheet
- of
- Author:
- File:

### Library data of the parts
C10 = C0805C104M5RACAUTO: as C3 on sheet 0-Hierarchy; Part Number: C0805C104M5RACAUTO; Value: 0.1µF; Applications: Automotive, Bypass, Decoupling; Capacitance: 0.1µF; ComponentLink1Description: Datasheet; ComponentLink1URL: https://api.kemet.com/component-edge/download/datasheet/C0805C104M5RACAUTO.pdf; ComponentLink2Description: DigiKey Link; ComponentLink2URL: http://digikey.com/product-detail/en/kemet/C0805C104M5RACAUTO/399-12977-1-ND/5762259; Device Package: 0805 (2012 Metric); LastUpdated: 2/09/2020 01:04:42; Lifecycle Status: Active; Minimum Order: 1; Mounting Type: Surface Mount, MLCC; Operating Temperature: -55°C ~ 125°C; Package / Case: 0805 (2012 Metric); Packaging: TapeAndReel; PartId: 2568; Part Status: Active; Price: 0.02; Ratings: AEC-Q200; Series: SMD Auto X7R; Size / Dimension: 0.079" L x 0.049" W (2.00mm x 1.25mm); Supplier 1: DigiKey; Supplier Part Number 1: 399-12977-1-ND; Temperature Coefficient: X7R; Thickness (Max): 0.035" (0.88mm); Voltage - Rated: 50V
J6 = CMP-2000-05541-1: as J1 on sheet 0-Hierarchy; Termination: Solder; Mounting Type: ThroughHole; Datasheet URL: http://www.te.com/commerce/DocumentDelivery/DDEController?Action=showdoc&DocId=Customer+Drawing%7F406549%7FT%7Fpdf%7FEnglish%7FENG_CD_406549_T.pdf%7F2-406549-1; Mounting Technology: ThroughHole; Package Reference: 2-406549-1; RoHS Information: 2-406549-1StatementofCompliance; Housing Material: Thermoplastic; Standard Package: 63; Number of Rows: 1; Category: Connectors,Interconnects; Contact Material: PhosphorBronze; Contact Finish Thickness: 50µin(1.27µm); Family: ModularConnectors-Jacks; Packaging: Tray; Datasheet Version: Rev. T, 11/2014; Operating Temperature: -40°C~85°C; Orientation: 90°Angle(Right); Contact Finish: Gold; Features: BoardGuide; Package Description: RJ45 Connector, Pitch 1.016 mm, 8 Position, Height 14.22 mm, Tail Length 3.18 mm; Manufacturer URL: http://www.te.com/
J7 = 61729-1011BLF: CONN RCPT USB2.0 TYPEB 4POS R/A; Manufacturer: Amphenol ICC (FCI); Connector Type: USB - B; Current Rating (Amps): 1A; Gender: Receptacle; Mating Cycles: 1500; Number of Contacts: 4; Number of Ports: 1; Shielding: Shielded; Part Number: 61729-1011BLF; ComponentLink1Description: Datasheet; ComponentLink1URL: http://www.amphenol-icc.com/media/wysiwyg/files/drawing/61729.pdf; ComponentLink2Description: DigiKey Link; ComponentLink2URL: //digikey.com/product-detail/en/amphenol-icc-fci/61729-1011BLF/609-3657-ND/1490763; Features: Board Lock; LastUpdated: 9/12/2019 8:52:52 p. m.; Lifecycle Status: 0; Minimum Order: 1; Mounting Feature: Horizontal; Mounting Type: Through Hole, Right Angle; Operating Temperature: -55°C ~ 85°C; Packaging: Tube; Part Status: Active; Price: 0.99; Series: 61729; Specifications: USB 2.0; Supplier 1: DigiKey; Supplier Part Number 1: 609-3657-ND; Termination: Solder

## Sheet 8-TemperatureSensor.SchDoc
size A4; Author: Fabian Castaño; CompanyName: UdeA; Engineer: Fabian Castaño; Organization: Universidad de Antioquia; Address1: UdeA; Address2: Medellín; Address3: Antioquia; Address4: Colombia 050010; DocumentNumber: 9; Revision: Jaime Osorio; SheetNumber: 9; SheetTotal: 12
Used 2 times, as channels T1W1, T1W2. Parts and nets are listed once, with the designators drawn on the sheet.
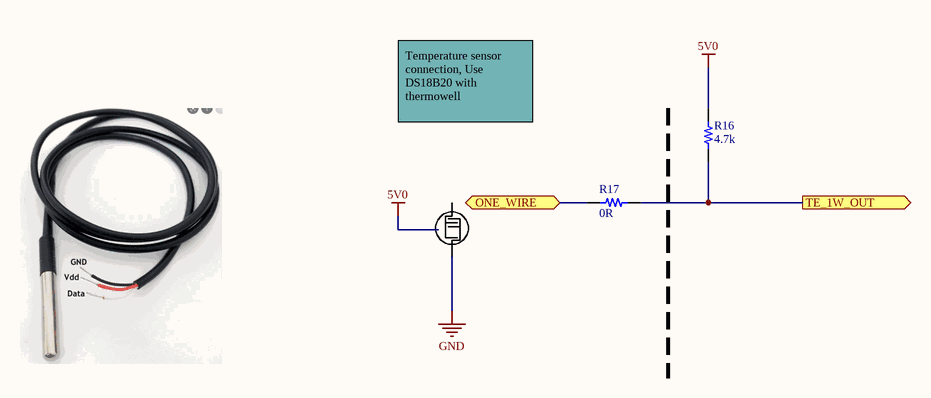
[diagram p8: 8-TemperatureSensor.SchDoc]

### Parts
R16  4.7k  [RES 0805_2012]
R17  0R  [RES 0805_2012]

### Ports
ONE_WIRE, TE_1W_OUT (out)

### Nets
5V0: R16.2
ONE_WIRE: R17.2 ; port ONE_WIRE
TE_1W_OUT: R16.1 R17.1 ; port TE_1W_OUT

### Channels
T1W1: designators end in _T1W1; ports ONE_WIRE=ONE_WIRE_1 TE_1W_OUT=T_1W_1
T1W2: designators end in _T1W2; ports ONE_WIRE=ONE_WIRE_2 TE_1W_OUT=T_1W_2

### Notes on the sheet
- Temperature sensor connection, Use DS18B20 with thermowell
- Title
- Size:
- Date:
- A4
- Enginner:
- Time:
- Revision:
- Sheet
- of
- Author:
- File:

### Library data of the parts
R16 R17 = RC0805FR-071K47L: as R1 on sheet 0-Hierarchy; Part Number: RC0805FR-071K47L; ComponentLink1Description: Datasheet; ComponentLink1URL: https://www.yageo.com/upload/media/product/productsearch/datasheet/rchip/PYu-RC_Group_51_RoHS_L_10.pdf; ComponentLink2Description: DigiKey Link; ComponentLink2URL: http://digikey.com/product-detail/en/yageo/RC0805FR-071K47L/311-1.47KCRCT-ND/730440; Composition: Thick Film; Device Package: 0805 (2012 Metric); Features: Moisture Resistant; Height - Seated (Max): 0.024" (0.60mm); LastUpdated: 2/09/2020 01:14:46; Lifecycle Status: Active; Minimum Order: 1; Number of Terminations: 2; Operating Temperature: -55°C ~ 155°C; Package / Case: 0805 (2012 Metric); Packaging: CutTape; PartId: 44768; Part Status: Active; Price: 0.10; Series: RC; Size / Dimension: 0.079" L x 0.049" W (2.00mm x 1.25mm); Supplier 1: DigiKey; Supplier Part Number 1: 311-1.47KCRCT-ND; Supplier Device Package: 0805; Tolerance: ±1%
  R16: Value: 4.7k
  R17: Value: 0R

## Sheet 9-FlowSensor.SchDoc
size A4; Author: Fabian Castaño; CompanyName: UdeA; Engineer: Fabian Castaño; Organization: Universidad de Antioquia; Address1: UdeA; Address2: Medellín; Address3: Antioquia; Address4: Colombia 050010; DocumentNumber: 10; Revision: Jaime Osorio; SheetNumber: 10; SheetTotal: 12
Used 2 times, as channels FS11, FS12. Parts and nets are listed once, with the designators drawn on the sheet.
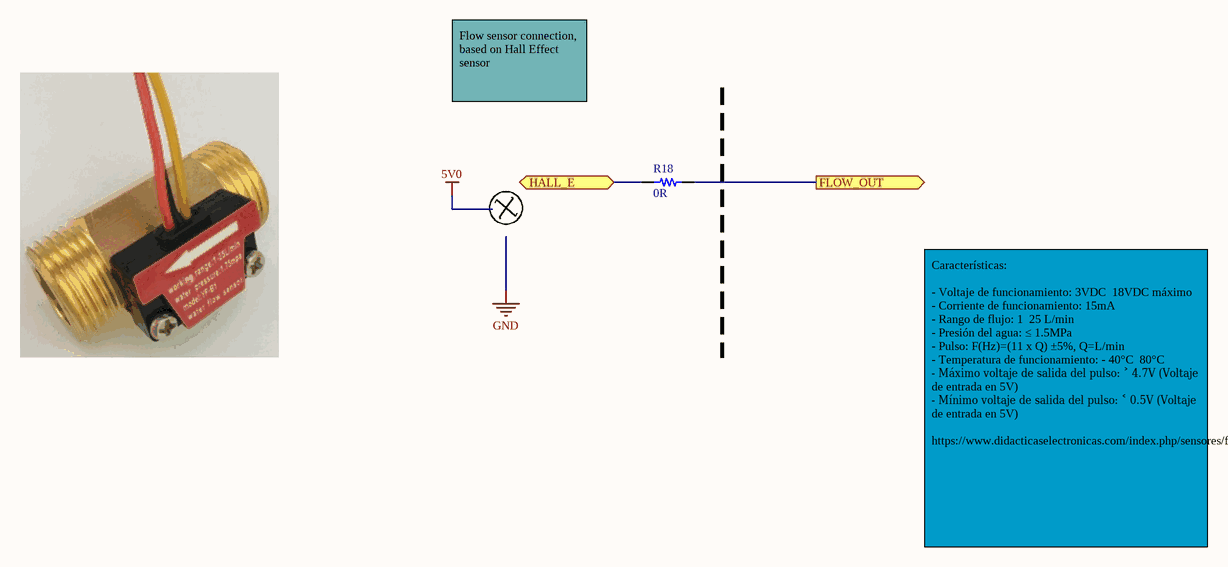
[diagram p9: 9-FlowSensor.SchDoc]

### Parts
R18  0R  [RES 0805_2012]

### Ports
FLOW_OUT (out), HALL_E

### Nets
FLOW_OUT: R18.1 ; port FLOW_OUT
HALL_E: R18.2 ; port HALL_E

### Channels
FS11: designators end in _FS11; ports FLOW_OUT=FS_1 HALL_E=HALL_E_1
FS12: designators end in _FS12; ports FLOW_OUT=FS_2 HALL_E=HALL_E_2

### Notes on the sheet
- Flow sensor connection, based on Hall Effect sensor
- Características:
  - Voltaje de funcionamiento: 3VDC  18VDC máximo
  - Corriente de funcionamiento: 15mA
  - Rango de flujo: 1  25 L/min
  - Presión del agua: ≤ 1.5MPa
  - Pulso: F(Hz)=(11 x Q) ±5%, Q=L/min
  - Temperatura de funcionamiento: - 40°C  80°C
  - Máximo voltaje de salida del pulso: ˃ 4.7V (Voltaje de entrada en 5V)
  - Mínimo voltaje de salida del pulso: ˂ 0.5V (Voltaje de entrada en 5V)
  https://www.didacticaselectronicas.com/index.php/sensores/flujo-y-nivel/sensor-de-flujo-de-agua-media-pulgada-lat%C3%B3n-yf-b1-v%C3%A1lvulas-sensores-de-flujo-de-fluido-de-agua-media-pulgada-detail
- Title
- Size:
- Date:
- A4
- Enginner:
- Time:
- Revision:
- Sheet
- of
- Author:
- File:

### Library data of the parts
R18 = RC0805FR-071K47L: as R1 on sheet 0-Hierarchy; Part Number: RC0805FR-071K47L; Value: 0R; ComponentLink1Description: Datasheet; ComponentLink1URL: https://www.yageo.com/upload/media/product/productsearch/datasheet/rchip/PYu-RC_Group_51_RoHS_L_10.pdf; ComponentLink2Description: DigiKey Link; ComponentLink2URL: http://digikey.com/product-detail/en/yageo/RC0805FR-071K47L/311-1.47KCRCT-ND/730440; Composition: Thick Film; Device Package: 0805 (2012 Metric); Features: Moisture Resistant; Height - Seated (Max): 0.024" (0.60mm); LastUpdated: 2/09/2020 01:14:46; Lifecycle Status: Active; Minimum Order: 1; Number of Terminations: 2; Operating Temperature: -55°C ~ 155°C; Package / Case: 0805 (2012 Metric); Packaging: CutTape; PartId: 44768; Part Status: Active; Price: 0.10; Series: RC; Size / Dimension: 0.079" L x 0.049" W (2.00mm x 1.25mm); Supplier 1: DigiKey; Supplier Part Number 1: 311-1.47KCRCT-ND; Supplier Device Package: 0805; Tolerance: ±1%

## Sheet 10-AdditionalSensors.SchDoc
size A4; Author: Fabian Castaño; CompanyName: UdeA; Engineer: Fabian Castaño; Organization: Universidad de Antioquia; Address1: UdeA; Address2: Medellín; Address3: Antioquia; Address4: Colombia 050010; DocumentNumber: 11; Revision: Jaime Osorio; SheetNumber: 11; SheetTotal: 12
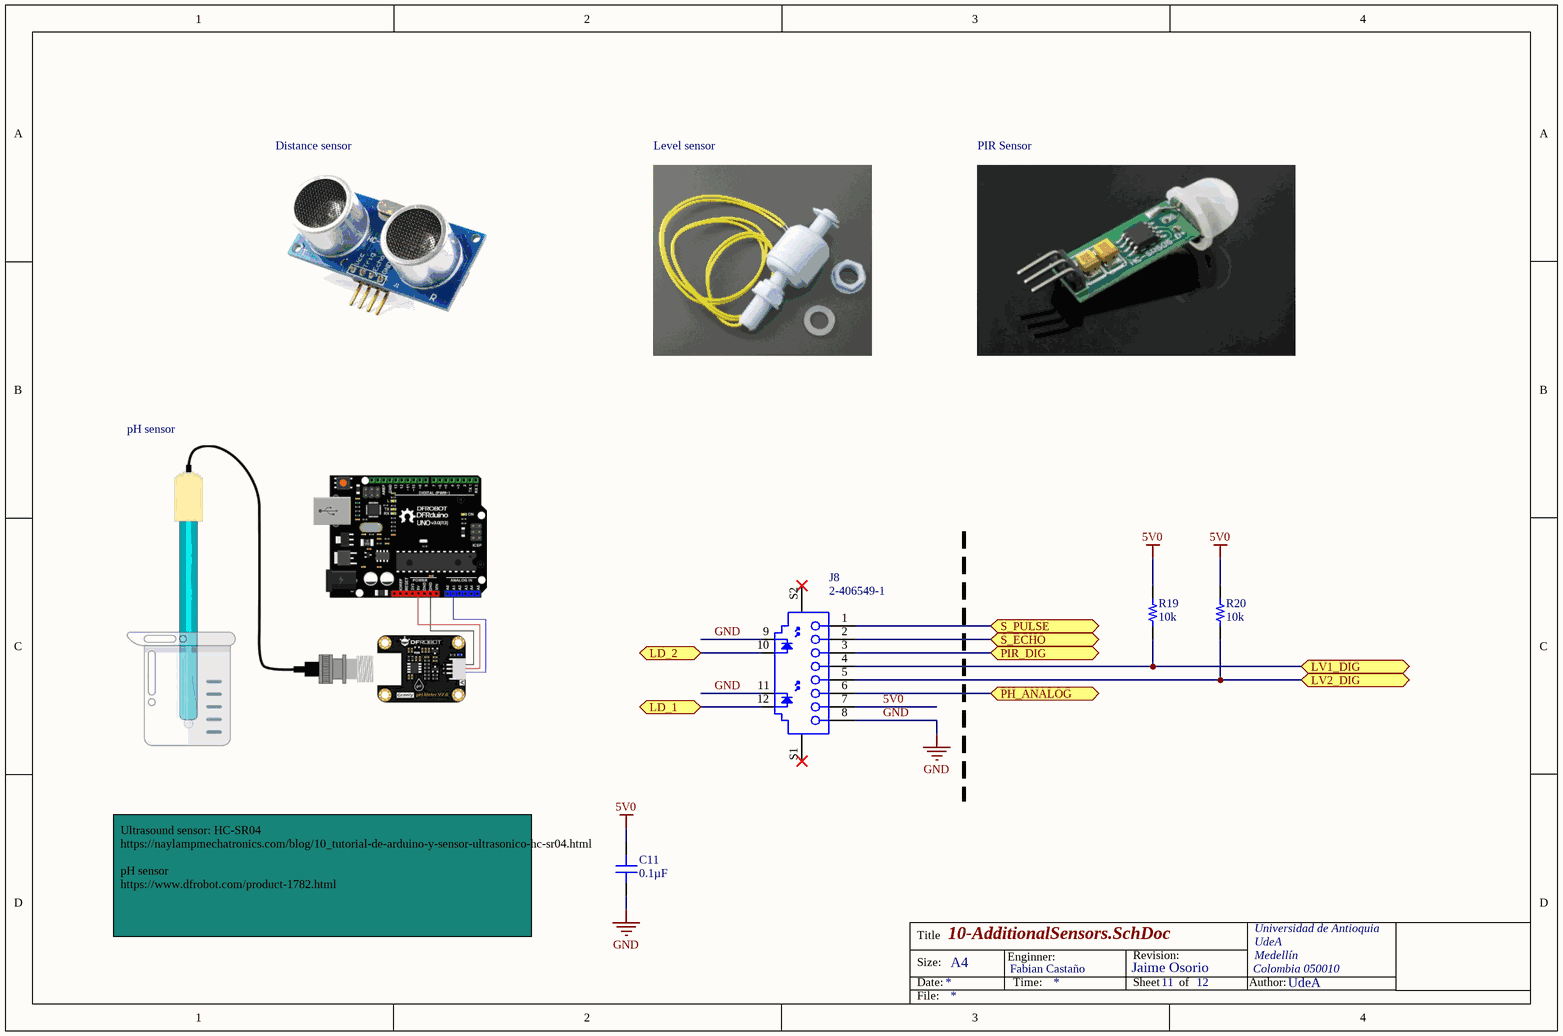
[diagram p10: 10-AdditionalSensors.SchDoc]

### Parts
C11  0.1µF  [CAP 0805_2012]
J8  2-406549-1  [TECO-2-406549-1_V]
R19  10k  [RES 0805_2012]
R20  10k  [RES 0805_2012]

### Ports
LD_1 (bidir), LD_2 (bidir), LV1_DIG, LV2_DIG, PH_ANALOG, PIR_DIG, S_ECHO, S_PULSE

### Nets
5V0: C11.2 J8.7 R19.2 R20.2
GND: C11.1 J8.8 J8.9 J8.11
NetJ8_1: J8.1 ; port S_PULSE
NetJ8_2: J8.2 ; port S_ECHO
NetJ8_3: J8.3 ; port PIR_DIG
NetJ8_4: J8.4 R19.1 ; port LV1_DIG
NetJ8_5: J8.5 R20.1 ; port LV2_DIG
NetJ8_6: J8.6 ; port PH_ANALOG
NetJ8_10: J8.10 ; port LD_2
NetJ8_12: J8.12 ; port LD_1

Not connected (* = marked no-connect by the designer): J8 S1* S2*

### Notes on the sheet
- Distance sensor
- Level sensor
- PIR Sensor
- pH sensor
- Ultrasound sensor: HC-SR04
  https://naylampmechatronics.com/blog/10_tutorial-de-arduino-y-sensor-ultrasonico-hc-sr04.html
  pH sensor
  https://www.dfrobot.com/product-1782.html
- Title
- Size:
- Date:
- A4
- Enginner:
- Time:
- Revision:
- Sheet
- of
- Author:
- File:

### Library data of the parts
C11 = C0805C104M5RACAUTO: as C3 on sheet 0-Hierarchy; Part Number: C0805C104M5RACAUTO; Value: 0.1µF; Applications: Automotive, Bypass, Decoupling; Capacitance: 0.1µF; ComponentLink1Description: Datasheet; ComponentLink1URL: https://api.kemet.com/component-edge/download/datasheet/C0805C104M5RACAUTO.pdf; ComponentLink2Description: DigiKey Link; ComponentLink2URL: http://digikey.com/product-detail/en/kemet/C0805C104M5RACAUTO/399-12977-1-ND/5762259; Device Package: 0805 (2012 Metric); LastUpdated: 2/09/2020 01:04:42; Lifecycle Status: Active; Minimum Order: 1; Mounting Type: Surface Mount, MLCC; Operating Temperature: -55°C ~ 125°C; Package / Case: 0805 (2012 Metric); Packaging: TapeAndReel; PartId: 2568; Part Status: Active; Price: 0.02; Ratings: AEC-Q200; Series: SMD Auto X7R; Size / Dimension: 0.079" L x 0.049" W (2.00mm x 1.25mm); Supplier 1: DigiKey; Supplier Part Number 1: 399-12977-1-ND; Temperature Coefficient: X7R; Thickness (Max): 0.035" (0.88mm); Voltage - Rated: 50V
J8 = CMP-2000-05541-1: as J1 on sheet 0-Hierarchy; Termination: Solder; Mounting Type: ThroughHole; Datasheet URL: http://www.te.com/commerce/DocumentDelivery/DDEController?Action=showdoc&DocId=Customer+Drawing%7F406549%7FT%7Fpdf%7FEnglish%7FENG_CD_406549_T.pdf%7F2-406549-1; Mounting Technology: ThroughHole; Package Reference: 2-406549-1; RoHS Information: 2-406549-1StatementofCompliance; Housing Material: Thermoplastic; Standard Package: 63; Number of Rows: 1; Category: Connectors,Interconnects; Contact Material: PhosphorBronze; Contact Finish Thickness: 50µin(1.27µm); Family: ModularConnectors-Jacks; Packaging: Tray; Datasheet Version: Rev. T, 11/2014; Operating Temperature: -40°C~85°C; Orientation: 90°Angle(Right); Contact Finish: Gold; Features: BoardGuide; Package Description: RJ45 Connector, Pitch 1.016 mm, 8 Position, Height 14.22 mm, Tail Length 3.18 mm; Manufacturer URL: http://www.te.com/
R19 R20 = RC0805FR-071K47L: as R1 on sheet 0-Hierarchy; Part Number: RC0805FR-071K47L; Value: 10k; ComponentLink1Description: Datasheet; ComponentLink1URL: https://www.yageo.com/upload/media/product/productsearch/datasheet/rchip/PYu-RC_Group_51_RoHS_L_10.pdf; ComponentLink2Description: DigiKey Link; ComponentLink2URL: http://digikey.com/product-detail/en/yageo/RC0805FR-071K47L/311-1.47KCRCT-ND/730440; Composition: Thick Film; Device Package: 0805 (2012 Metric); Features: Moisture Resistant; Height - Seated (Max): 0.024" (0.60mm); LastUpdated: 2/09/2020 01:14:46; Lifecycle Status: Active; Minimum Order: 1; Number of Terminations: 2; Operating Temperature: -55°C ~ 155°C; Package / Case: 0805 (2012 Metric); Packaging: CutTape; PartId: 44768; Part Status: Active; Price: 0.10; Series: RC; Size / Dimension: 0.079" L x 0.049" W (2.00mm x 1.25mm); Supplier 1: DigiKey; Supplier Part Number 1: 311-1.47KCRCT-ND; Supplier Device Package: 0805; Tolerance: ±1%